# EAGLE design MUDE - Rev A (EAGLE 7.3.0)

## Sheet 1 of 2
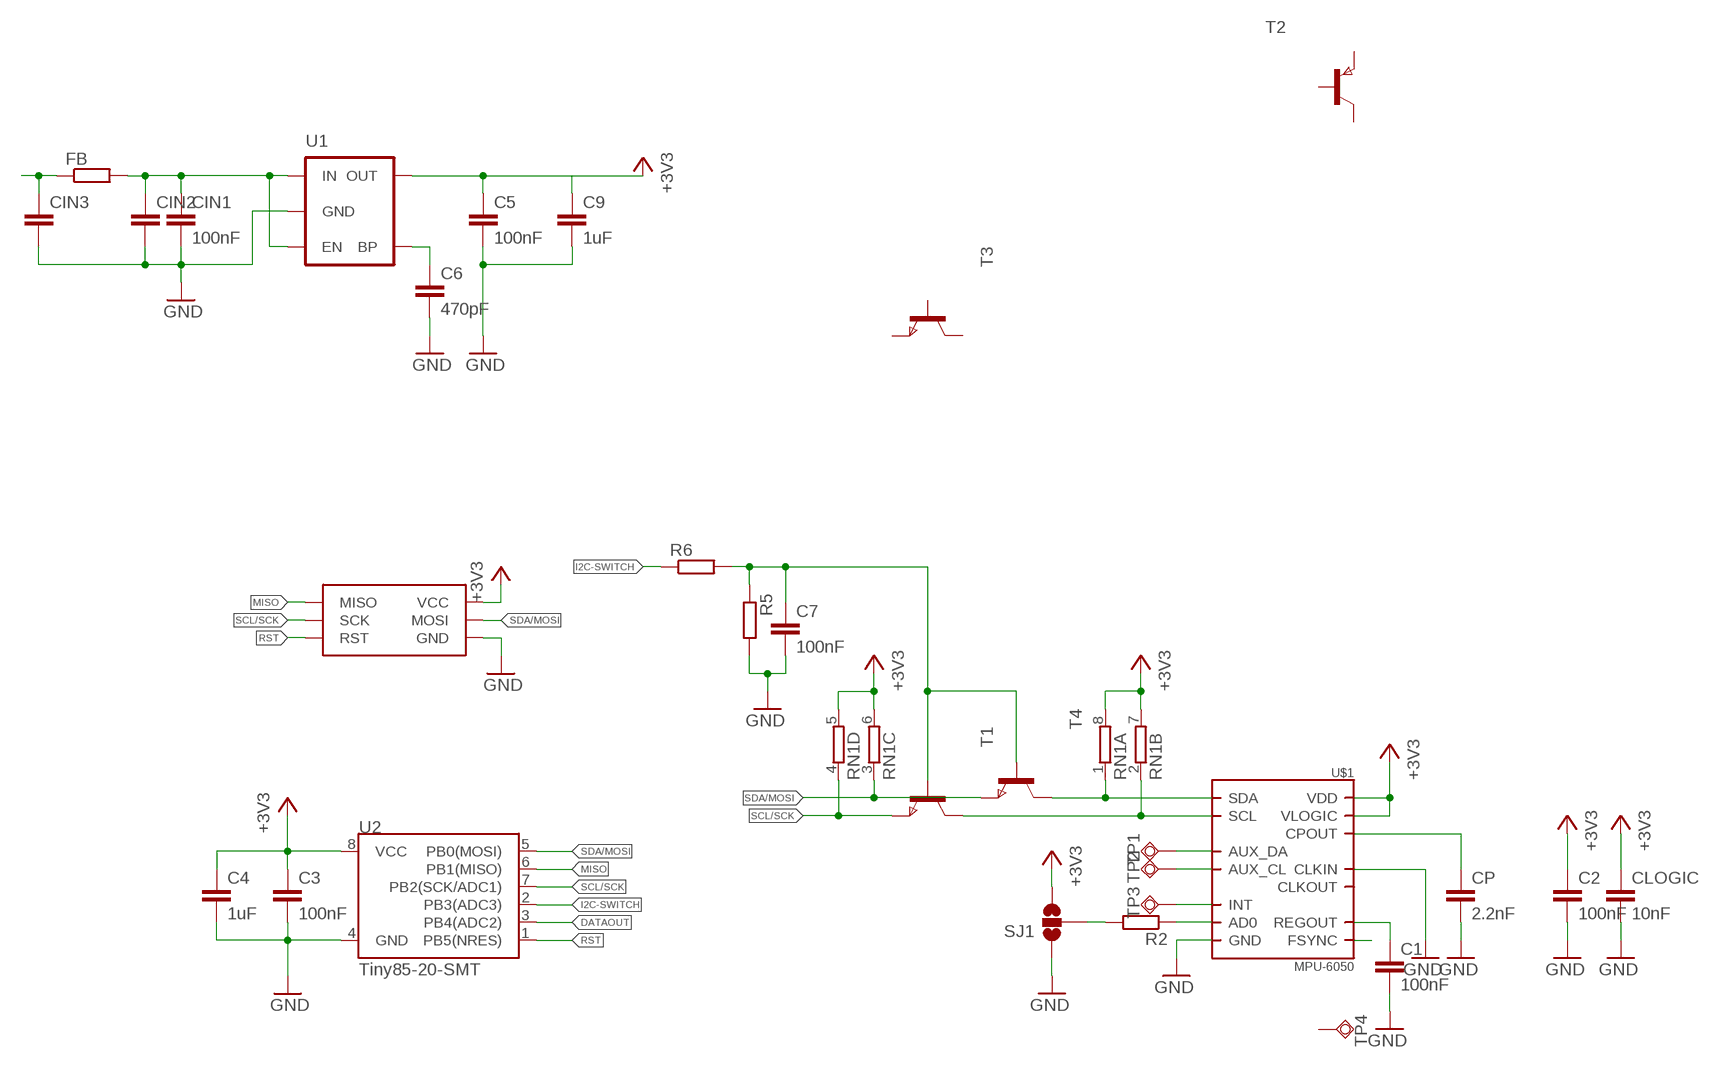
[diagram p0: schematic, sheet 1]

### Parts
C1  100nF  C-EUC0603  [C0603]
C2  100nF  C-EUC0603  [C0603]
C3  100nF  C-EUC0603  [C0603]
C4  1uF  C-EUC0603  [C0603]
C5  100nF  C-EUC0603  [C0603]
C6  470pF  C-EUC0603  [C0603]
C7  100nF  C-EUC0603  [C0603]
C9  1uF  C-EUC0603  [C0603]
CIN1  100nF  C-EUC0603  [C0603]
CIN2  C-EUC0805  [C0805]
CIN3  C-EUC0805  [C0805]
CLOGIC  10nF  C-EUC0603  [C0603]
CP  2.2nF  C-EUC0603  [C0603]
FB  R-EU_R0603  [R0603]
R2  R-EU_R0603  [R0603]
R5  R-EU_R0603  [R0603]
R6  R-EU_R0603  [R0603]
RN1  4R-N0603-ARV  [0603-ARV]
SJ1  SOLDERJUMPER_2WAYS  [SJ_3]
T1  NPNSOT323  [SOT323]
T2  PNPSOT323  [SOT323]
T3  NPNSOT323  [SOT323]
T4  NPNSOT323  [SOT323]
TP1  TPSQTP10R  [TP10R]
TP2  TPSQTP10R  [TP10R]
TP3  TPSQTP10R  [TP10R]
TP4  TPSQTP14R  [TP14R]
U1  MIC52053.3V  [SOT23-5]
U2  Tiny85-20-SMT  ATTINY45TINY85-20-SMT  [SO08-EIAJ]
U$1  MPU-6050  [QFN.24.4X4]
U$3  ISP_POGOISP_POGO  [ISP_POGO]

### Nets
+3V3: C2.1 C3.1 C4.1 C5.1 C9.1 CLOGIC.1 RN1.5 RN1.6 RN1.7 RN1.8 SJ1.3 U1.5(OUT) U2.8(VCC) U$1.8(VLOGIC) U$1.13(VDD) U$3.VCC
DATAOUT: U2.3(PB4(ADC2))
GND: C1.2 C2.2 C3.2 C4.2 C5.2 C6.2 C7.2 C9.2 CIN1.2 CIN2.2 CIN3.2 CLOGIC.2 CP.2 R5.2 SJ1.1 U1.2(GND) U2.4(GND) U$1.1(CLKIN) U$1.18(GND) U$3.GND
I2C-SWITCH: R6.1 U2.2(PB3(ADC3))
MISO: U2.6(PB1(MISO)) U$3.MISO
N$1: CP.1 U$1.20(CPOUT)
N$2: R2.1 U$1.9(AD0)
N$3: CIN1.1 CIN2.1 FB.2 U1.1(IN) U1.3(EN)
N$4: TP1.TP U$1.6(AUX_DA)
N$5: C6.1 U1.4(BP)
N$6: TP2.TP U$1.7(AUX_CL)
N$7: RN1.1 T4.1(C) U$1.24(SDA)
N$8: R2.2 SJ1.2
N$9: RN1.2 T1.1(C) U$1.23(SCL)
N$11: TP3.TP U$1.12(INT)
N$12: C1.1 U$1.10(REGOUT)
N$13: U$1.11(FSYNC)
N$15: CIN3.1 FB.1
N$17: C7.1 R5.1 R6.2 T1.2(B) T4.2(B)
RST: U2.1(PB5(NRES)) U$3.RST
SCL/SCK: RN1.4 T1.3(E) U2.7(PB2(SCK/ADC1)) U$3.SCK
SDA/MOSI: RN1.3 T4.3(E) U2.5(PB0(MOSI)) U$3.MOSI
Unconnected: T2.1(C) T2.2(B) T2.3(E) T3.1(C) T3.2(B) T3.3(E) TP4.TP U$1.22(CLKOUT)

## Sheet 2 of 2

## Library data of the parts
C1-C7 C9 CIN1-CIN3 CLOGIC CP = wes:C-EU: CAPACITOR, European symbol
FB R2 R5 R6 = wes:R-EU_: RESISTOR, European symbol
RN1 = resistor-dil:4R-N: Array Chip Resistor Source: RS Component / Phycomp; OC_FARNELL: unknown; OC_NEWARK: unknown
SJ1 = SparkFun-Passives:SOLDERJUMPER_2WAY: Solder Jumper 2 way solder jumper
T1 T3 T4 = zetex:NPNSOT323: NPN TRANSISTOR; MPN: DSS4160U-7; OC_FARNELL: 1710696; OC_NEWARK: 25R4558
T2 = zetex:PNPSOT323: PNP TRANSISTOR; MPN: 2DB1689-7; OC_FARNELL: 1710698; OC_NEWARK: 25R5667
TP1-TP4 = testpad:TPSQ: Test pad
U1 = SparkFun-PowerIC:MIC5205: MIC5205 150mA vreg 3.3V - VREG-00822 5V - VREG-00823; PROD_ID: VREG-00822
U2 = SparkFun-DigitalIC:ATTINY45: Atmel 8-pin 2/4/8kB flash uC; PROD_ID: IC-09092
U$1 = invensense:MPU-6050
U$3 = wes:ISP_POGO

## Board
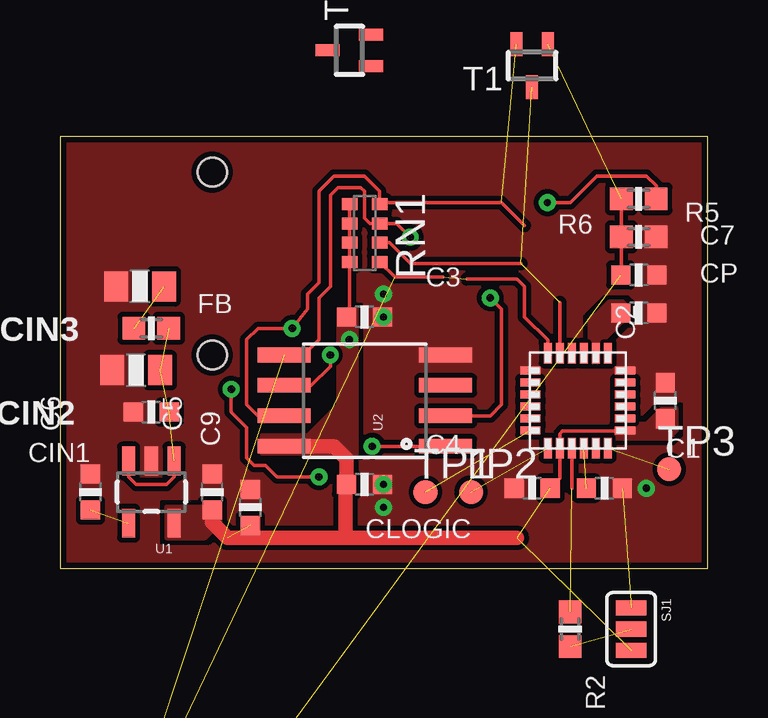
[diagram p1: board, top side]
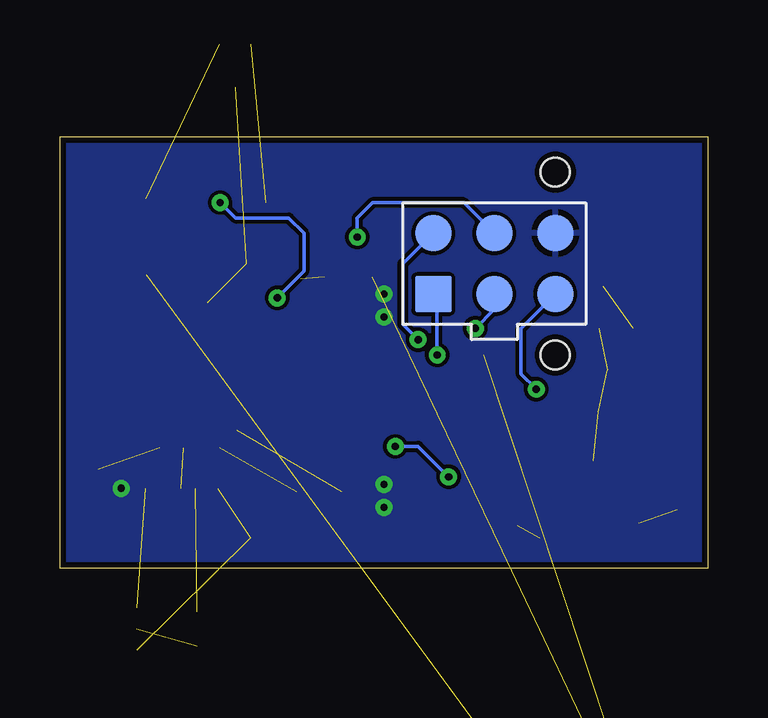
[diagram p2: board, bottom side, seen from below]

Size 27 x 18 mm. Coordinates in mm from the lower left corner, seen from the top.
Outline: 0,0 27,0 27,18 0,18 0,0
Copper layers (1*16): Top 0.035mm / dielectric 1.5mm / Bottom 0.035mm
Design rules "default *": minimum track width 6mil, minimum drill 0.3mm, track to track 6mil, track to pad 6mil, pad to pad 6mil, via to via 6mil, smd to smd 6mil, copper to edge 10mil, drill to drill 20mil, minimum pad ring 10mil, minimum via ring 8mil, stop-mask expansion 4mil, vias tented up to drill 0.3mm, thermal gap 10mil

### Footprints (pad centres in the part's own frame; a part is rotated, then mirrored left to right if it is on the bottom)
C0603 = smd 0.8 x 0.8: 1 -0.75,0; 2 0.75,0
C0805 = smd 1 x 1.25: 1 -1,0; 2 1,0
R0603 = smd 0.95 x 0.95: 1 -0.725,0; 2 0.725,0
0603-ARV = smd 0.5 x 0.65: 1 -1.2,-0.625; 2 -0.4,-0.625; 3 0.4,-0.625; 4 1.2,-0.625; 5 1.2,0.625; 6 0.4,0.625; 7 -0.4,0.625; 8 -1.2,0.625
SJ_3 = smd 0.635 x 1.27: 1 -0.889,0; 2 0,0; 3 0.889,0
SOT323 = smd 0.5 x 1: 1 0,0.9; 2 -0.65,-0.9; 3 0.65,-0.9
TP10R = smd 1 x 1: TP 0,0
TP14R = smd 1.4 x 1.4: TP 0,0
SOT23-5 = smd 0.55 x 1.2: 1 -0.95,-1.3; 2 0,-1.3; 3 0.95,-1.3; 4 0.95,1.3; 5 -0.95,1.3
SO08-EIAJ = smd 0.61 x 2.21: 1 -1.905,-3.378; 2 -0.635,-3.378; 3 0.635,-3.378; 4 1.905,-3.378; 5 1.905,3.353; 6 0.635,3.353; 7 -0.635,3.353; 8 -1.905,3.353
QFN.24.4X4 = smd 0.85 x 0.33: 1 -1.975,1.25; 2 -1.975,0.75; 3 -1.975,0.25; 4 -1.975,-0.25; 5 -1.975,-0.75; 6 -1.975,-1.25; 13 1.975,-1.25; 14 1.975,-0.75; 15 1.975,-0.25; 16 1.975,0.25; 17 1.975,0.75; 18 1.975,1.25 | smd 0.33 x 0.85: 7 -1.25,-1.975; 8 -0.75,-1.975; 9 -0.25,-1.975; 10 0.25,-1.975; 11 0.75,-1.975; 12 1.25,-1.975; 19 1.25,1.975; 20 0.75,1.975; 21 0.25,1.975; 22 -0.25,1.975; 23 -0.75,1.975; 24 -1.25,1.975
ISP_POGO = smd 1.524 x 1.524: GND 1.27,-2.54; MISO -1.27,2.54; MOSI 1.27,0; RST -1.27,-2.54; SCK -1.27,0; VCC 1.27,2.54 | hole 1.2: -3.81,-2.54; 3.81,-2.54

### Placement (x,y rotation side)
C1  22.7,3.33 0 top
C2  25.24,6.99 90 top
C3  12.7,10.48 0 top
C4  12.7,3.49 0 top
C5  6.35,3.17 90 top
C6  1.27,3.17 90 top
C7  24.13,12.22 0 top
C9  7.94,2.54 90 top
CIN1  3.81,6.51 180 top
CIN2  3.17,8.26 180 top
CIN3  3.33,11.75 180 top
CLOGIC  19.68,3.33 180 top
CP  24.13,10.64 0 top
FB  3.81,10 0 top
R2  21.27,-2.54 270 top
R5  24.13,13.81 0 top
R6  24.13,15.4 180 top
RN1  12.7,13.97 90 top
SJ1  23.81,-2.54 270 top
T1  19.68,20.95 180 top
T2  12.06,21.59 90 top
T3  -1.91,-19.05 0 top  (outside the outline)
T4  -1.91,-22.23 0 top  (outside the outline)
TP1  15.24,3.17 0 top
TP2  17.14,3.17 0 top
TP3  25.4,4.13 0 top
TP4  -1.91,-15.88 0 top  (outside the outline)
U1  3.81,3.17 180 top
U2  12.7,6.99 90 top
U$1  21.59,6.99 0 top
U$3  8.89,12.7 90 bottom

### Tracks (layer width: path | path; a pad name or v marks a point on that pad's centre or on a via)
+3V3  (via drill 0.3 pad 0.5)  (3 unrouted)
  Top 0.152: RN1.5 RN1.6 RN1.7 RN1.8 12.07,10.6 C3.1 11.95,10.28 | CLOGIC.1 20.84,3.74 U$1.8 20.84,5.6 20.95,5.71 23.55,5.71 U$1.13 | C5.1 6.35,1.91 | C4.1 11.91,3.45
  Top 0.61: U2.8 11.43,5.08 11.95,4.56 C4.1 | 6.35,1.91 6.99,1.27 11.91,1.27 | 11.91,1.27 19.05,1.27 | 11.91,3.45 11.91,1.27
  Bottom 0.152: U$3.VCC 12.7,12.7 12.7,10.16 v12.06,9.53
  pour Top (no thermals): 6.67,2.54 4.45,2.54 4.45,1.27 6.03,1.27 6.67,1.91
  pour Top (no thermals): 23.18,6.03 24.45,6.03 25.08,6.67 25.72,6.67 25.72,5.71 25.4,5.4 23.18,5.4
  pour Top (no thermals): 8.41,4.76 12.38,4.76 12.38,10.79 11.59,10.79 11.59,6.83 10.32,5.56 8.41,5.56
GND  (via drill 0.3 pad 0.5)  (1 unrouted)
  other vias: 13.49,11.43 13.49,2.54 13.49,3.49 13.49,10.48 24.45,3.33
  pour Top (isolate 0.203, rank 6, no thermals): 0,26.04 48.26,26.04 48.26,0 0,0
  pour Bottom: -1.91,22.23 -1.91,-1.91 27.3,-1.91 27.3,22.23
I2C-SWITCH  (via drill 0.3 pad 0.5)
  Top 0.152: R6.1 24.86,15.94 24.45,16.35 22.38,16.35 21.27,15.24 v20.32,15.24 | U2.2 17.94,6.35 18.41,6.83 18.41,10.79 v17.94,11.27
  Bottom 0.152: v20.32,15.24 19.68,14.61 17.46,14.61 16.83,13.97 16.83,12.38 v17.94,11.27
MISO  (via drill 0.3 pad 0.5)
  Top 0.152: U2.6 10.48,7.62 11.27,8.41 v11.27,8.89
  Bottom 0.152: v11.27,8.89 11.27,11.27 U$3.MISO
N$1
  pour Top (no thermals): 23.5,11.11 22.86,11.11 22.07,10.32 22.07,8.73 22.23,8.57 22.38,8.57 22.54,8.73 22.54,9.37 23.65,10.48 23.65,10.95
N$2  (1 unrouted)
  Top 0.152: U$1.9 21.34,3.33
N$3  (3 unrouted)
  Top 0.152: U1.3 2.86,3.81 3.17,3.49 4.45,3.49 4.76,3.81 U1.1
N$4  (1 unrouted)
N$5  (1 unrouted)
N$6  (1 unrouted)
N$7  (2 unrouted)
  Top 0.152: U$1.24 20.34,9.51 19.37,10.48 19.37,11.75 19.05,12.06 16.98,12.06 | 15.97,12.13 13.96,12.13 RN1.1
N$8  (1 unrouted)
N$9  (2 unrouted)
  Top 0.152: U$1.23 20.84,11.08 | 19.22,12.7 14.61,12.7 13.73,13.57 RN1.2
N$11  (1 unrouted)
N$12  (1 unrouted)
N$15  (1 unrouted)
N$17  (2 unrouted)
  Top 0.152: R6.2 R5.1 | R5.1 23.41,12.41 C7.1 | 23.23,13.8 R5.1
RST  (via drill 0.3 pad 0.5)
  Top 0.152: U2.1 v13.02,5.08 | v10.79,3.81 9.05,3.81 8.57,4.29 8.1,4.29 7.78,4.6 7.78,5.87 7.14,6.51 v7.14,7.46
  Bottom 0.152: v13.02,5.08 12.06,5.08 v10.79,3.81 | v7.14,7.46 7.78,8.1 7.78,10 U$3.RST
SCL/SCK  (via drill 0.3 pad 0.5)  (1 unrouted)
  Top 0.152: 19.37,14.29 18.41,15.24 13.39,15.24 RN1.4 13.32,15.73 12.7,16.35 11.43,16.35 10.79,15.72 10.79,11.91 10.32,11.43 10.32,10.79 v9.68,10 8.26,10 7.78,9.53 7.78,6.83 8.26,6.35 U2.7
  Bottom 0.152: U$3.SCK 8.89,10.79 v9.68,10
SDA/MOSI  (via drill 0.3 pad 0.5)  (1 unrouted)
  Top 0.152: RN1.3 14.04,14.37 v14.61,13.8 | RN1.3 12.94,14.37 | U2.5 10.16,8.89 10.79,9.53 10.79,11.27 11.27,11.75 11.27,15.56 11.59,15.88 12.54,15.88 12.7,15.72 12.7,14.61 12.94,14.37 RN1.3
  Bottom 0.152: U$3.MOSI 10.16,15.24 13.97,15.24 14.61,14.61 v14.61,13.8